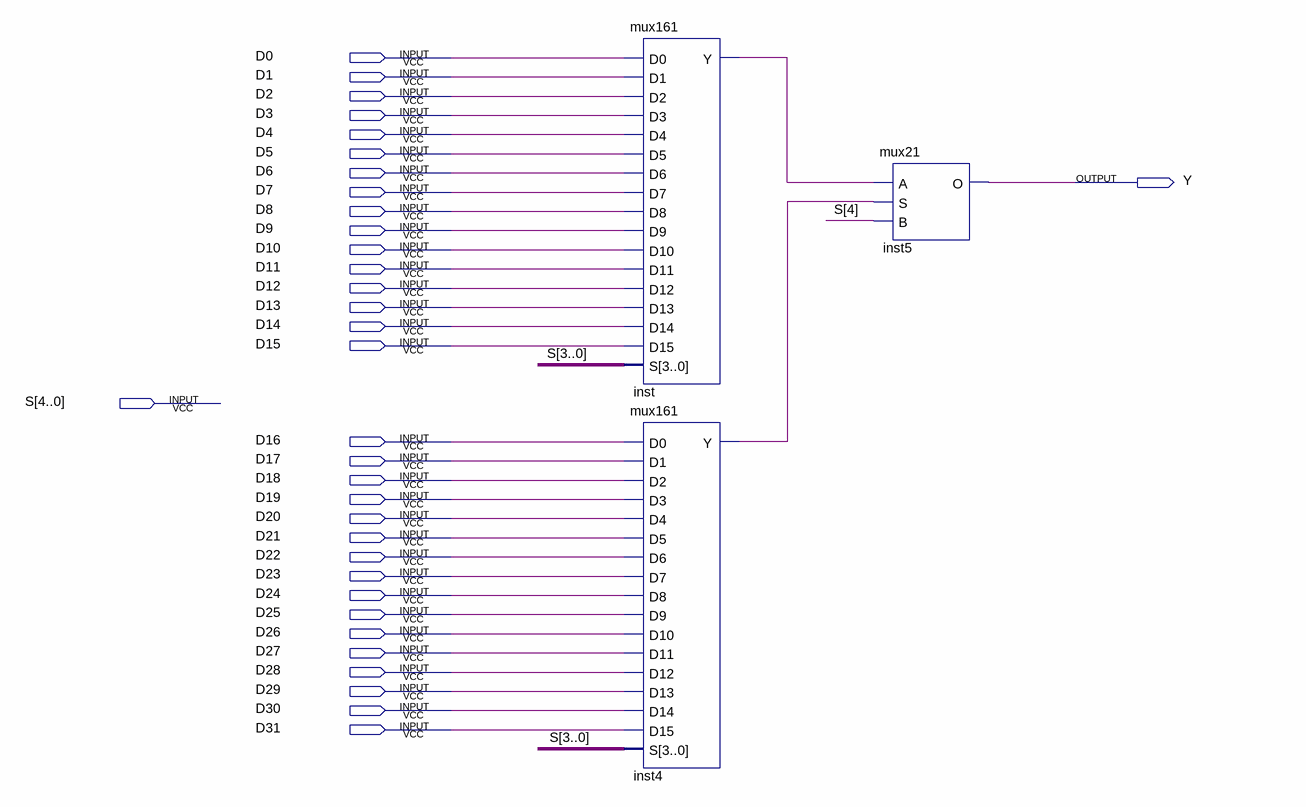
[diagram p0: schematic sheet]
// Quartus schematic mux321.bdf as structural Verilog: 3 symbols, 34 pins
module mux321 (
  input  D0,
  input  D1,
  input  D2,
  input  D3,
  input  D4,
  input  D5,
  input  D6,
  input  D7,
  input  D8,
  input  D9,
  input  D10,
  input  D11,
  input  D12,
  input  D13,
  input  D14,
  input  D15,
  input  [4:0] S,
  input  D16,
  input  D17,
  input  D18,
  input  D19,
  input  D20,
  input  D21,
  input  D22,
  input  D23,
  input  D24,
  input  D25,
  input  D26,
  input  D27,
  input  D28,
  input  D29,
  input  D30,
  input  D31,
  output Y
);

  wire inst4_y, inst_y;

  mux161 inst (
    .D0(D0), .D1(D1), .D2(D2), .D3(D3), .D4(D4), .D5(D5), .D6(D6), .D7(D7), .D8(D8), .D9(D9), .D10(D10),
    .D11(D11), .D12(D12), .D13(D13), .D14(D14), .D15(D15), .S(S[3:0]), .Y(inst_y));
  mux161 inst4 (
    .D0(D16), .D1(D17), .D2(D18), .D3(D19), .D4(D20), .D5(D21), .D6(D22), .D7(D23), .D8(D24), .D9(D25),
    .D10(D26), .D11(D27), .D12(D28), .D13(D29), .D14(D30), .D15(D31), .S(S[3:0]), .Y(inst4_y));
  mux21 inst5 (.A(inst_y), .S(inst4_y), .B(S[4]), .O(Y));
endmodule
